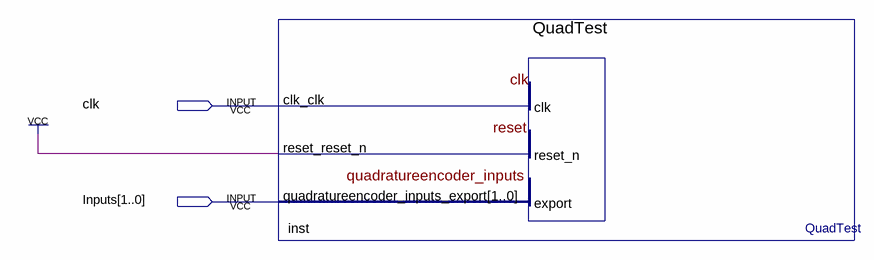
[diagram p0: schematic sheet]
// Quartus schematic QuadDecTest.bdf as structural Verilog: 1 symbols, 2 pins
module QuadDecTest (
  input  clk,
  input  [1:0] Inputs
);

  QuadTest inst (.clk_clk(clk), .reset_reset_n(1'b1), .quadratureencoder_inputs_export(Inputs));
endmodule
